# EAGLE design wifilight (EAGLE 7.5.0)
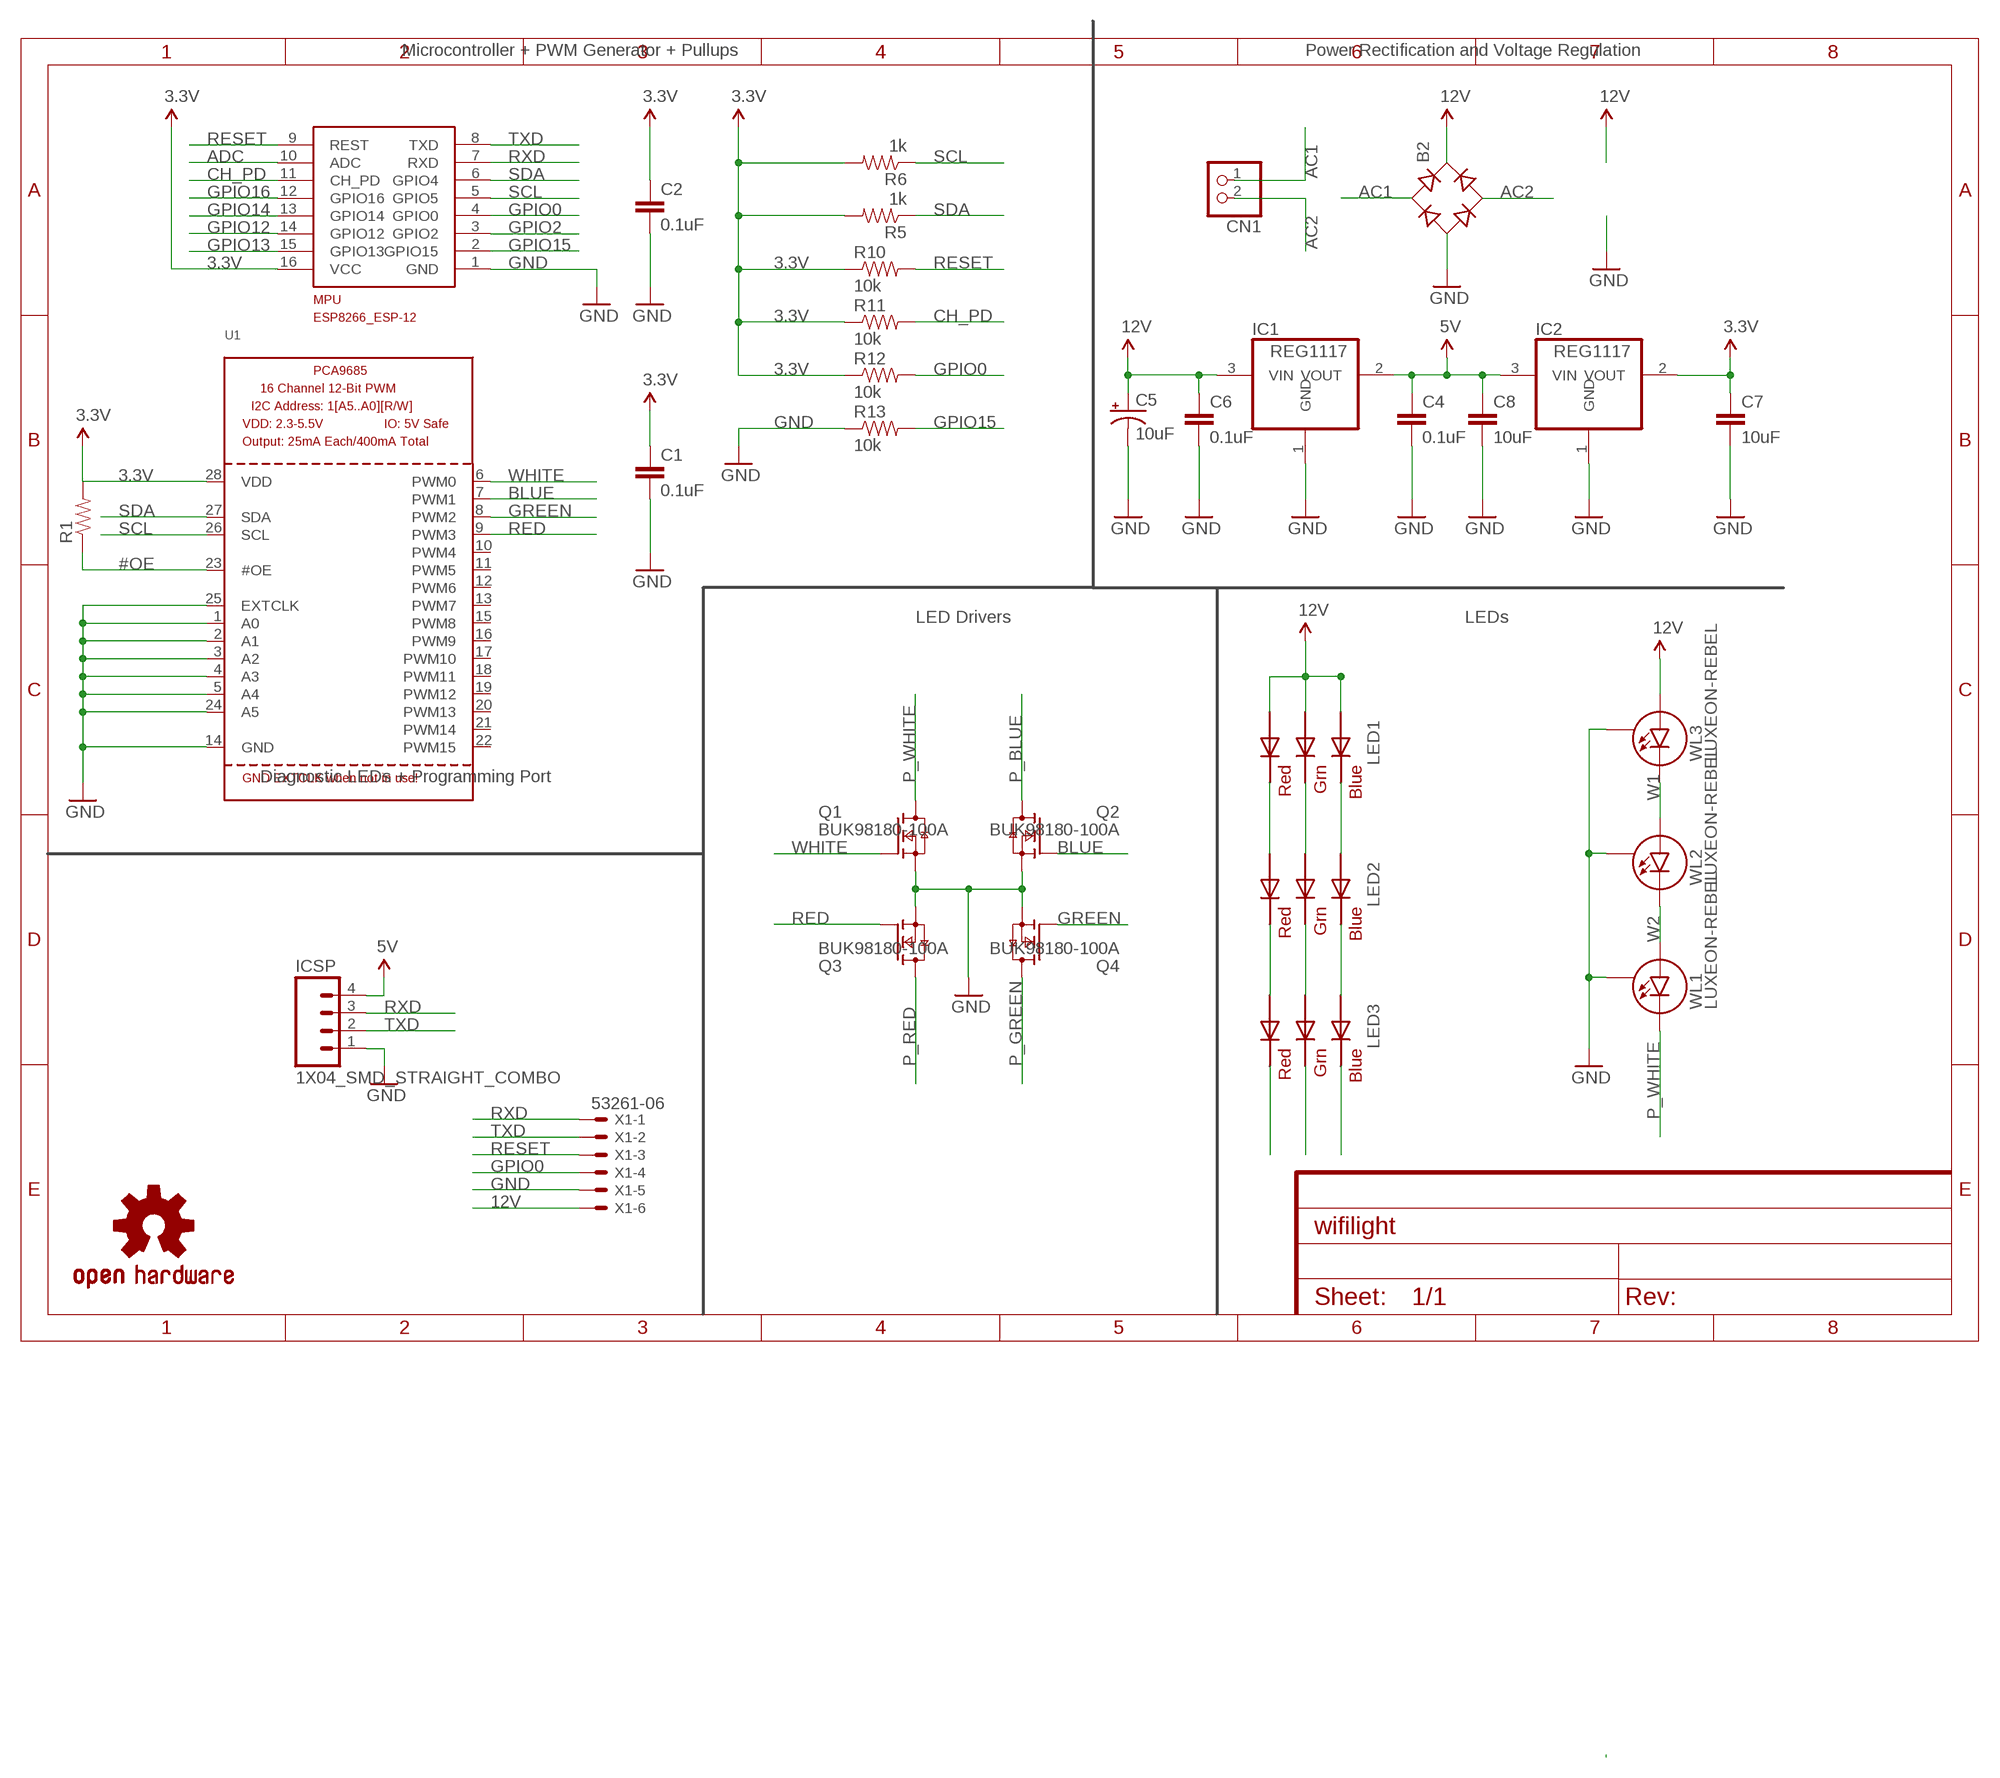
[diagram p0: schematic, sheet 1]

## Parts
B2  DBLS203G  [DBS]
C1  0.1uF  CAP1206  [1206]
C2  0.1uF  CAP1206  [1206]
C4  0.1uF  CAP1206  [1206]
C5  10uF  10UF-16V-10%(TANT)  [EIA3216]
C6  0.1uF  CAP1206  [1206]
C7  10uF  CAP1206  [1206]
C8  10uF  CAP1206  [1206]
CN1  JST_2PIN-THM  [JST-PH-2-THM]
IC1  REG1117  [SOT223]
IC2  REG1117  [SOT223]
ICSP  1X04_SMD_STRAIGHT_COMBO  M04SMD_STRAIGHT_COMBO  [1X04_SMD_STRAIGHT_COMBO]
LED1  RGBLED5050  [RGBLED5050]
LED2  RGBLED5050  [RGBLED5050]
LED3  RGBLED5050  [RGBLED5050]
LOGO1  OSHW-LOGOS  [OSHW-LOGO-S]
MPU  ESP8266_ESP-12  [ESP8266-ESP12]
Q1  BUK98180-100A  [SOT223]
Q2  BUK98180-100A  [SOT223]
Q3  BUK98180-100A  [SOT223]
Q4  BUK98180-100A  [SOT223]
R1  RESISTOR1206  [1206]
R5  1k  RESISTOR1206  [1206]
R6  1k  RESISTOR1206  [1206]
R10  10k  RESISTOR1206  [1206]
R11  10k  RESISTOR1206  [1206]
R12  10k  RESISTOR1206  [1206]
R13  10k  RESISTOR1206  [1206]
U1  PCA9685  [TSSOP28]
WL1  LUXEON-REBEL  [LUXEON-REBEL]
WL2  LUXEON-REBEL  [LUXEON-REBEL]
WL3  LUXEON-REBEL  [LUXEON-REBEL]
X1  53261-06  [53261-06]

## Nets
3.3V: C1.1 C2.1 C7.1 IC2.2(VOUT) MPU.16(VCC) R1.2 R5.2 R6.2 R10.1 R11.1 R12.1 U1.28(VDD)
5V: C4.1 C8.1 IC1.2(VOUT) IC2.3(VIN) ICSP.4
12V: B2.+ C5.A(+) C6.1 IC1.3(VIN) LED1.1(GREEN_A) LED1.2(RED_A) LED1.3(BLUE_A) WL3.ANODE(A) X1.6
#OE: R1.1 U1.23(#OE)
AC1: B2.AC1 CN1.1
AC2: B2.AC2 CN1.2
ADC: MPU.10(ADC)
BLUE: Q2.1(G) U1.7(PWM1)
CH_PD: MPU.11(CH_PD) R11.2
GND: B2.- C1.2 C2.2 C4.2 C5.C(-) C6.2 C7.2 C8.2 ICSP.1 MPU.1(GND) Q1.3(S) Q2.3(S) Q3.3(S) Q4.3(S) R13.1 U1.1(A0) U1.2(A1) U1.3(A2) U1.4(A3) U1.5(A4) U1.14(GND) U1.24(A5) U1.25(EXTCLK) WL1.P$3(S) WL2.P$3(S) WL3.P$3(S) X1.5
GPIO0: MPU.4(GPIO0) R12.2 X1.4
GPIO2: MPU.3(GPIO2)
GPIO12: MPU.14(GPIO12)
GPIO13: MPU.15(GPIO13)
GPIO14: MPU.13(GPIO14)
GPIO15: MPU.2(GPIO15) R13.2
GPIO16: MPU.12(GPIO16)
GREEN: Q4.1(G) U1.8(PWM2)
N$30: LED2.5(RED_C) LED3.2(RED_A)
N$31: LED2.6(GREEN_C) LED3.1(GREEN_A)
N$32: LED2.4(BLUE_C) LED3.3(BLUE_A)
N$33: LED1.5(RED_C) LED2.2(RED_A)
N$34: LED1.6(GREEN_C) LED2.1(GREEN_A)
N$35: LED1.4(BLUE_C) LED2.3(BLUE_A)
P_BLUE: LED3.4(BLUE_C) Q2.2(D) Q2.4(D)
P_GREEN: LED3.6(GREEN_C) Q4.2(D) Q4.4(D)
P_RED: LED3.5(RED_C) Q3.2(D) Q3.4(D)
P_WHITE: Q1.2(D) Q1.4(D) WL1.CATHODE(C)
RED: Q3.1(G) U1.9(PWM3)
RESET: MPU.9(REST) R10.2 X1.3
RXD: ICSP.3 MPU.7(RXD) X1.1
SCL: MPU.5(GPIO5) R6.1 U1.26(SCL)
SDA: MPU.6(GPIO4) R5.1 U1.27(SDA)
TXD: ICSP.2 MPU.8(TXD) X1.2
W1: WL2.ANODE(A) WL3.CATHODE(C)
W2: WL1.ANODE(A) WL2.CATHODE(C)
WHITE: Q1.1(G) U1.6(PWM0)
Unconnected: U1.10(PWM4) U1.11(PWM5) U1.12(PWM6) U1.13(PWM7) U1.15(PWM8) U1.16(PWM9) U1.17(PWM10) U1.18(PWM11) U1.19(PWM12) U1.20(PWM13) U1.21(PWM14) U1.22(PWM15)

## Notes on the sheet
- Microcontroller + PWM Generator + Pullups | Power Rectification and Voltage Regulation
- LED Drivers | LEDs
- Diagnostic LEDs + Programming Port

## Power pins joined to a net without a drawn wire
GND: IC1.1(GND) IC2.1(GND)

## Library data of the parts
B2 = rectifier:DB?*G: Single Phase 1.0 AMP Glass Passivated Bridge Rectifier Taiwan Semiconductor Co.,Ltd. - TSC Source: http://www.taiwansemi.com/TSCbig5/ezcatfiles/cust/img/img/db101g.pdf http://www.ts.com.tw/db/pictures/modules/PDT/PDT060207001/DBLS201G.pdf
C1 C2 C4 C6-C8 = SparkFun-Passives:CAP: Capacitor Standard 0603 ceramic capacitor, and 0.1" leaded capacitor.
C5 = SparkFun-Capacitors:10UF-16V-10%(TANT): CAP-00811 1206/EIA-3216 Tantalum capacitor; PROD_ID: CAP-00811
CN1 = adafruit:JST_2PIN: JST 2-Pin Connectors of various flavors SMT-RA (S2B-PH-SM4) 4UConnector #17311 SMT (B2B-PH-SM4) THM-RA (S2B-PH) THM (B2B-PH)
IC1 IC2 = burr-brown:REG1117: 800mA and 1A Low Dropout (LDO) Positive Regulator 1.8V, 2.5V, 2.85V, 3.3V, 5V, and Adj; MPN: REG1117; OC_FARNELL: 1097566; OC_NEWARK: 14P6981
ICSP = SparkFun-Connectors:M04: Header 4 Standard 4-pin 0.1" header. Use with straight break away headers (SKU : PRT-00116), right angle break away headers (PRT-00553), swiss pins (PRT-00743), machine pins (PRT-00117), and female headers (PRT-00115). Molex polarized connector foot print use with SKU : PRT-08231 with associated crimp pins and housings. 1MM SMD Version SKU: PRT-10208; PROD_ID: CONN-08511
LED1-LED3 = adafruit:RGBLED: For 5050 RGB LEDs, the order of the LEDs may vary from one manufacturer to another!
LOGO1 = SparkFun-Aesthetics:OSHW-LOGO: Open Source Hardware Logo This logo indicates the piece of hardware it is found on incorporates a OSHW license and/or adheres to the definition of open source hardware found here: http://freedomdefined.org/OSHW
MPU = ESP8266-ESP12:ESP8266_ESP-12
Q1-Q4 = nxp_60:BUK98180-100A: N-channel TrenchMOS logic level FET Logic level N-channel enhancement mode Field-Effect Transistor (FET) in a plastic package using TrenchMOS technology. This product has been designed and qualified to the appropriate AEC standard for use in automotive critical applications. AAL Eindhoven MK
R1 R10-R13 = SparkFun-Resistors:RESISTOR: Resistor Basic schematic elements and footprints for 0603, 1206, and PTH resistors.
R5 R6 = SparkFun-Passives:RESISTOR: Resistor Basic schematic elements and footprints for 0603, 1206, and PTH resistors.
U1 = adafruit:PCA9685: PCA9685 - 16 Channel 12-Bit I2C PWM Controller 5.0V tolerant 16 channel, 12-bit I2C PWM controller with 25mA per output (max. 400mA total) Digikey: 568-5931-1-ND
WL1-WL3 = SparkFun-LED:LUXEON-REBEL: Luxeon Rebel single-color high output LED
X1 = con-molex:53?-06: CONNECTOR wire to board 1.25 mm (.049 inch) pitch header; OC_FARNELL: 1125375; OC_NEWARK: unknown

## Board
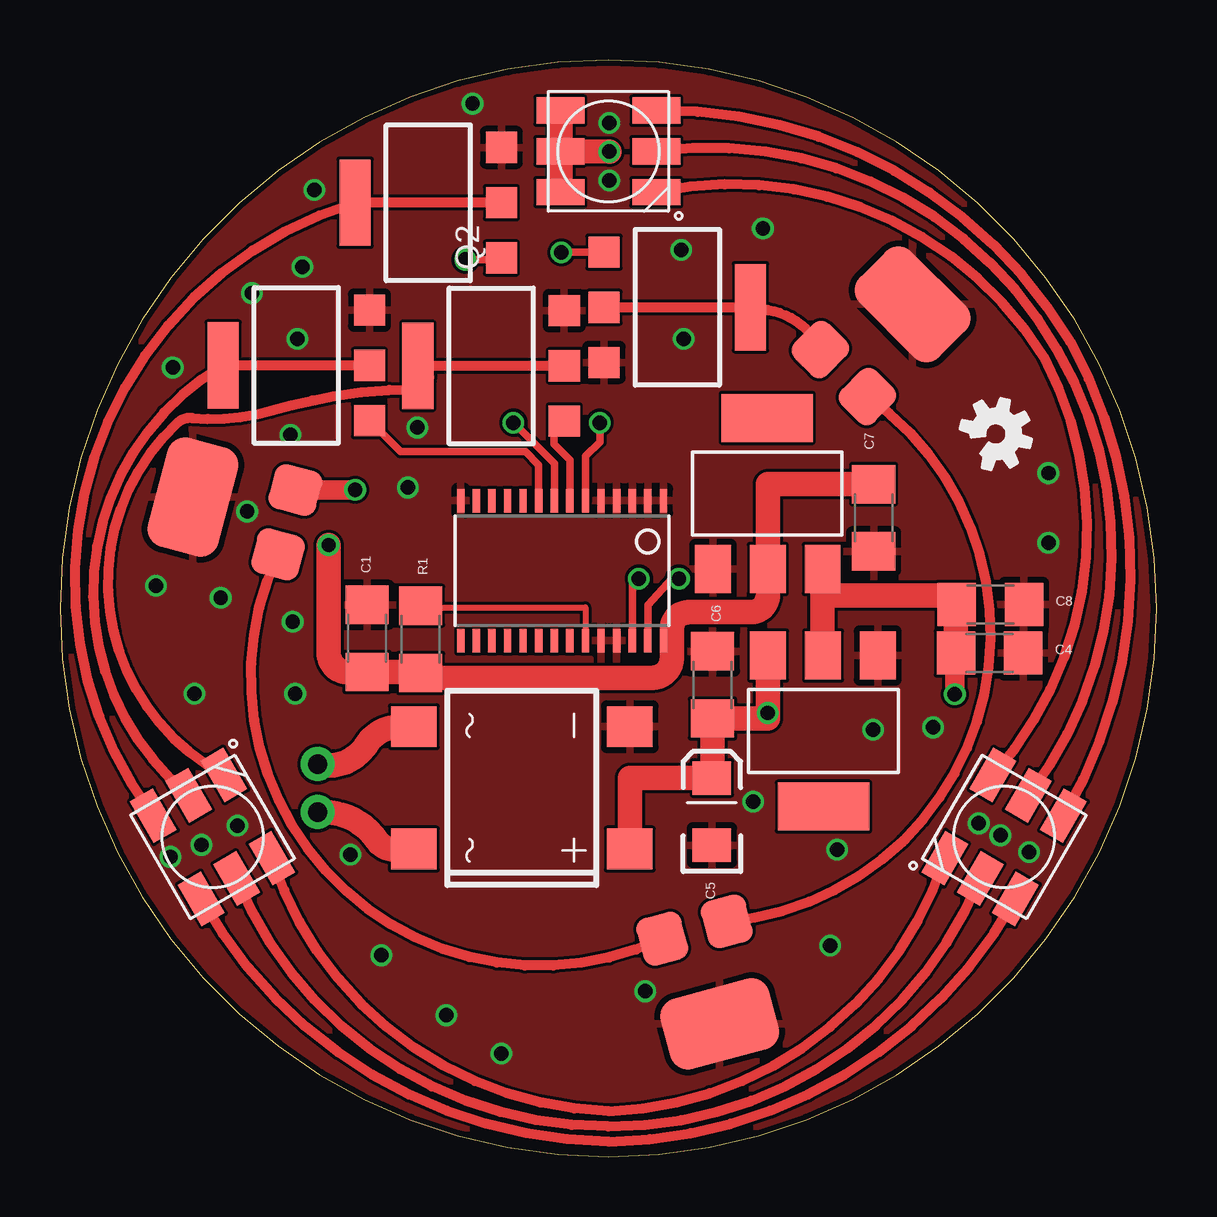
[diagram p1: board, top side]
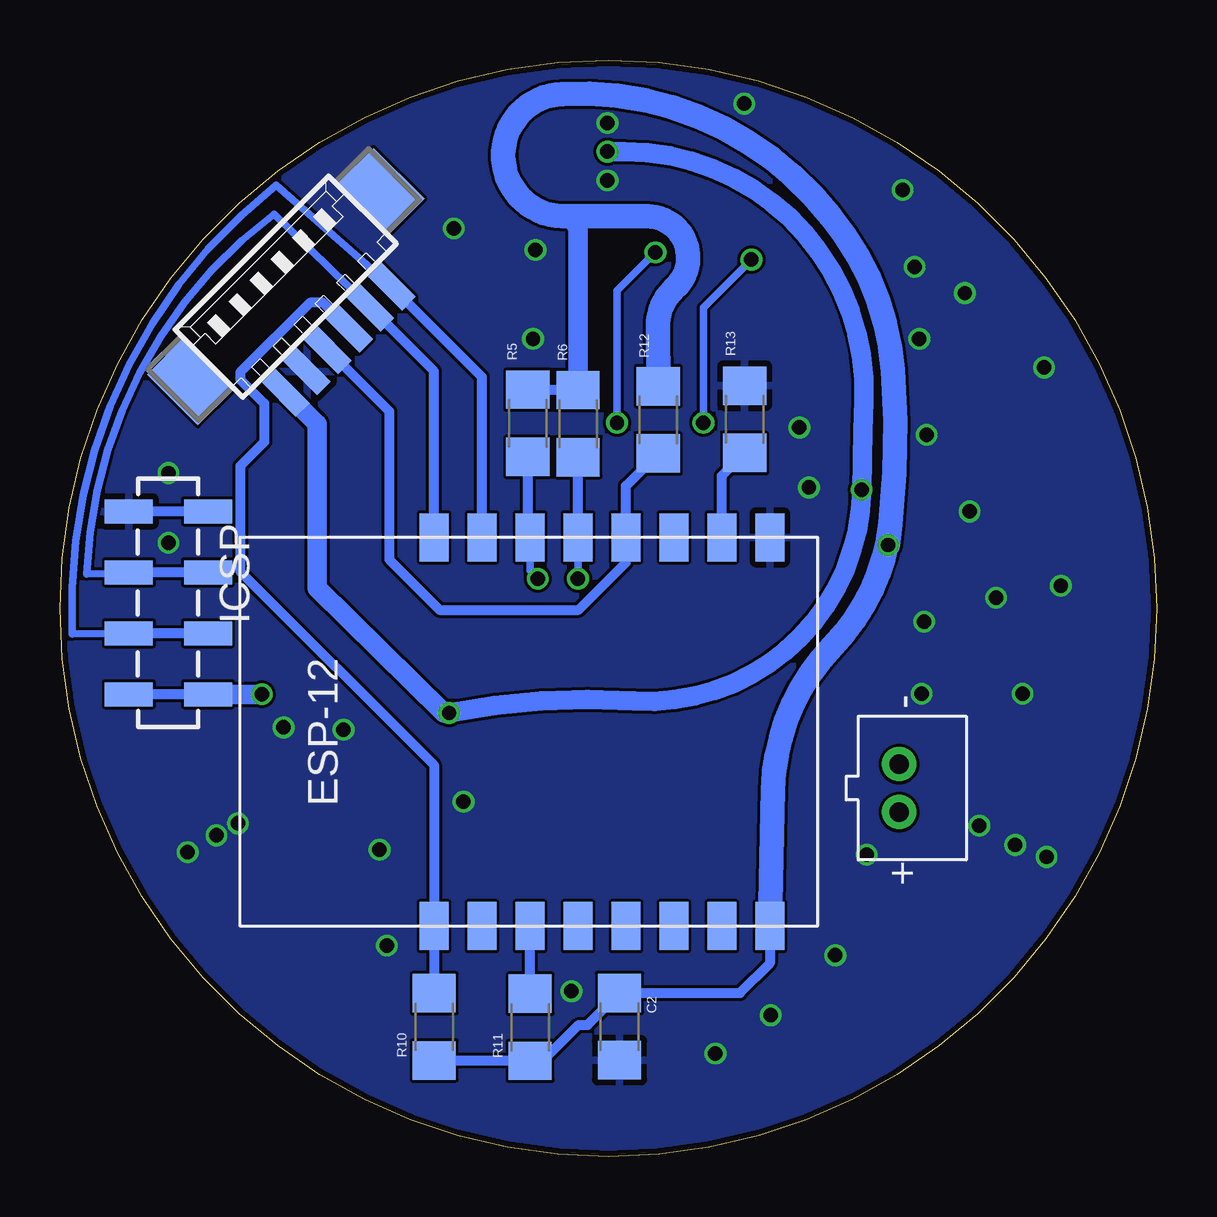
[diagram p2: board, bottom side, seen from below]

Size 45.72 x 45.72 mm. Coordinates in mm from the lower left corner, seen from the top.
Outline: 22.86,0 arc90 45.72,22.86 arc90 22.86,45.72 arc90 0,22.86 arc90 22.86,0
Copper layers (1*16): Top 0.035mm / dielectric 1.5mm / Bottom 0.035mm
Design rules "dirtypcbs": minimum track width 5mil, minimum drill 12mil, track to track 5mil, track to pad 5mil, pad to pad 5mil, via to via 5mil, smd to smd 0mil, copper to edge 10mil, drill to drill 10mil, minimum pad ring 10mil, minimum via ring 6mil, stop-mask expansion 2mil, vias tented up to drill 25mil, thermal gap 10mil

### Footprints (pad centres in the part's own frame; a part is rotated, then mirrored left to right if it is on the bottom)
DBS = smd 1.7 x 1.9: + -2.55,-4.5; - 2.55,-4.5; AC1 -2.55,4.5; AC2 2.55,4.5
1206 = smd 1.6 x 1.8: 1 -1.4,0; 2 1.4,0
EIA3216 = smd 1.4 x 1.6: A 1.4,0; C -1.4,0
JST-PH-2-THM = drill 0.8 pad 1.422: 1 1,0; 2 -1,0
SOT223 = smd 1.499 x 2.007: 1 -2.261,-3.15; 2 0.025,-3.15; 3 2.311,-3.15 | smd 3.81 x 2.007: 4 0,3.15
1X04_SMD_STRAIGHT_COMBO = smd 1 x 2: 1 0,-1.65; 1-2 0,1.65; 2 2.54,1.65; 2-2 2.54,-1.65; 3 5.08,-1.65; 3-2 5.08,1.65; 4 7.62,1.65; 4-2 7.62,-1.65
RGBLED5050 = smd 2 x 1.1: 1 -2,1.7; 2 -2,0; 3 -2,-1.7; 4 2,-1.7; 5 2,0; 6 2,1.7
ESP8266-ESP12 = smd 2 x 1.2: 1 16.2,2; 2 16.2,4; 3 16.2,6; 4 16.2,8; 5 16.2,10; 6 16.2,12; 7 16.2,14; 8 16.2,16; 9 0,16; 10 0,14; 11 0,12; 12 0,10; 13 0,8; 14 0,6; 15 0,4; 16 0,2
SOT223' = smd 1.3 x 1.3: 1 -2.3,-3.05; 2 0,-3.05; 3 2.3,-3.05 | smd 3.6 x 1.3: 4 0,3.05
TSSOP28 = smd 0.305 x 0.991: 1 -4.225,-2.918; 2 -3.575,-2.918; 3 -2.925,-2.918; 4 -2.275,-2.918; 5 -1.625,-2.918; 6 -0.975,-2.918; 7 -0.325,-2.918; 8 0.325,-2.918; 9 0.975,-2.918; 10 1.625,-2.918; 11 2.275,-2.918; 12 2.925,-2.918; 13 3.575,-2.918; 14 4.225,-2.918; 15 4.225,2.918; 16 3.575,2.918; 17 2.925,2.918; 18 2.275,2.918; 19 1.625,2.918; 20 0.975,2.918; 21 0.325,2.918; 22 -0.325,2.918; 23 -0.975,2.918; 24 -1.625,2.918; 25 -2.275,2.918; 26 -2.925,2.918; 27 -3.575,2.918; 28 -4.225,2.918
LUXEON-REBEL = smd 1.91 x 2.03: ANODE -1.39,2.63; CATHODE 1.39,2.63 | smd 4.68 x 3.03: P$3 0,-1.42
53261-06 = smd 0.8 x 2: 1 3.125,-2.5; 2 1.875,-2.5; 3 0.625,-2.5; 4 -0.625,-2.5; 5 -1.875,-2.5; 6 -3.125,-2.5 | smd 2.1 x 3: S1 5.625,0.625; S2 -5.625,0.625

### Placement (x,y rotation side)
B2  19.25,15.38 90 top
C1  12.8,21.61 90 top
C2  22.4,5.43 270 bottom
C4  38.75,21 0 top
C5  27.17,14.39 90 top
C6  27.2,19.67 90 top
C7  33.92,26.64 270 top
C8  38.78,23.02 0 top
CN1  10.74,15.37 270 bottom
IC1  31.83,17.75 180 top
IC2  29.48,27.65 0 top
ICSP  41.2,26.9 270 bottom
LED1  22.86,41.91 0 top
LED2  39.36,13.34 240 top
LED3  6.36,13.34 120 top
LOGO1  39.01,30.13 300 top
MPU  14.13,9.62 90 bottom
Q1  BUK98180-100A  [SOT223']  25.73,35.41 270 top
Q2  BUK98180-100A  [SOT223']  17.97,32.97 90 top
Q3  BUK98180-100A  [SOT223']  9.85,32.99 90 top
Q4  BUK98180-100A  [SOT223']  15.35,39.77 90 top
R1  15.03,21.57 270 top
R5  26.22,30.58 90 bottom
R6  24.12,30.56 90 bottom
R10  30.12,5.42 90 bottom
R11  26.12,5.4 90 bottom
R12  20.78,30.72 270 bottom
R13  17.18,30.74 270 bottom
U1  20.93,24.43 180 top
WL1  34.53,34.53 135 top
WL2  27.13,6.91 15 top
WL3  6.91,27.13 255 top
X1  35.87,35.83 45 bottom

### Tracks (layer width: path | path; a pad name or v marks a point on that pad's centre or on a via)
3.3V  (via drill 0.6)
  Top 0.254: R1.2 14.9,20.1 14.9,19.97
  Top 0.305: U1.28 25.31,21.51 arc90 25.5,21.7 | C1.1 14.39,20.21 arc-90 14.4,20.2
  Top 0.406: 24.7,19.97 25.16,19.97 | 14.77,20.21 R1.2
  Top 1.016: C7.1 29.5,28.04 IC2.2 29.5,23.41 arc-90 28.8,22.7 26.2,22.7 arc90 25.5,22 25.5,21.7 25.5,20.77 arc-90 24.7,19.97 14.9,19.97 | C1.1 14.77,20.21 | 14.4,20.2 12,20.2 arc-90 11.2,21 v11.2,25.5
  Bottom 0.406: R6.2 26.22,31.96 R5.2 | MPU.16 16.13,8.07 17.37,6.83 C2.1 23.73,5.5 24.1,5.5 25.6,4 R11.1 26.14,4.02 R10.1
  Bottom 0.813: R6.2 24.12,38.52 arc-90 24.8,39.2
  Bottom 1.016: R12.1 20.8,34.6 arc48 20.1,36.2 arc-142 21.4,39.2 24.8,39.2 arc175 24.8,44.3 arc55 13.6,39.2 arc35 11,32.8 arc11 11.1,26.4 | 11.1,26.4 arc38 13.5,21.3 arc-43 16,15.3 MPU.16 | v11.2,25.5 11.1,26.4
5V  (via drill 0.6)
  Top 0.305: 37.3,21 C4.1
  Top 0.813: v37.3,19.28 37.3,21
  Top 1.016: IC2.3 31.79,23.4 | 31.79,23.4 31.79,21.21 IC1.2 | C8.1 37.35,23.02 C4.1 37.35,23.4 31.79,23.4
  Bottom 0.813: ICSP.4 v37.3,19.28
12V  (via drill 0.6)
  Top 0.406: v29.5,18.5 29.37,18.57 C6.1
  Top 0.813: WL3.ANODE v12.29,27.79 arc90 v12.3,27.8
  Top 1.016: IC1.3 29.52,18.27 C6.1 27.2,16.09 C5.A 23.75,15.79 B2.+ | LED1.2 LED1.3 21.21,40.21 | LED1.2 LED1.1 | v22.9,41.9 LED1.2
  Bottom 0.406: 29.7,18.5 v29.5,18.5
  Bottom 0.813: X1.6 35,30.54 35,23.7 29.7,18.5 | v22.9,41.9 22.2,41.9 arc92 12.2,31.5 arc-1 v12.3,27.8 arc93 21.8,19 arc-14 v29.5,18.5
#OE
  Top 0.254: 14.9,22.9 21.91,22.9 U1.23
  Top 1.016: R1.1 14.9,23.07 14.9,22.9
AC1
  Top 1.016: B2.AC1 14,12.8 arc-58 13.2,13.2 arc60 CN1.1
AC2
  Top 1.016: B2.AC2 14,17.9 arc56 12.8,17.2 arc-73 CN1.2
BLUE
  Top 0.305: U1.7 21.25,29.05 20.6,29.7 20.6,30.25 Q2.1
CH_PD
  Bottom 0.406: R11.2 MPU.11
GND  (via drill 0.6)
  other vias: 14.9,30.4 10.6,40.3 26,34.1 29.3,38.7 25.9,37.8 17.2,43.9 22.9,43.1 22.9,40.7 9.9,34.1 10.1,37.1 4.7,32.9 7.4,13.8 5.9,13 4.6,12.5 5.6,19.3 9.8,19.3 12.1,12.6 9.7,22.3 6.7,23.3 4,23.8 7.8,26.9 9.6,30.1 8,36 14.5,27.9 18.4,4.3 16.1,5.9 13.4,8.4 24.4,6.9 32.1,8.8 32.4,12.8 28.9,14.8 33.9,17.8 40.4,12.7 39.2,13.4 38.3,13.9 36.4,17.9 41.2,25.6 41.2,28.5
  pour Top: 22.86,45.72 arc90 0,22.86 arc90 22.86,0 arc90 45.72,22.86 arc90
  pour Bottom: 22.86,45.72 arc90 0,22.86 arc90 22.86,0 arc90 45.72,22.86 arc90
GPIO0
  Bottom 0.406: R12.2 22.13,27.97 MPU.4 22.13,24.77 24.1,22.8 29.9,22.8 32,24.9 32,31.08 X1.4
GPIO15
  Bottom 0.406: MPU.2 18.13,28.39 R13.2
GREEN  (via drill 0.6)
  Top 0.305: U1.8 20.61,28.89 v18.9,30.6 | v16.9,37.4 18.33,37.4 Q4.1
  Bottom 0.305: v18.9,30.6 18.9,35.4 v16.9,37.4
N$30
  Top 0.406: LED3.2 arc68 22.86,1.27 arc68 LED2.5
N$31
  Top 0.406: LED3.1 arc60 22.86,0.64 arc60 LED2.6
N$32
  Top 0.406: LED3.3 arc70 22.86,1.91 arc70 LED2.4
N$33
  Top 0.406: LED1.5 arc-68 41.56,33.66 arc-68 LED2.2
N$34
  Top 0.406: LED1.6 arc-60 42.11,33.97 arc-60 LED2.1
N$35
  Top 0.406: LED2.3 arc70 41.01,33.34 arc70 LED1.4
P_BLUE
  Top 0.406: LED3.4 arc-109 4.9,30.6 arc-48 5.5,30.8 arc22 8.8,31.1 arc-6 11.4,31.7 arc-10 14.9,32 arc178 Q2.4 Q2.2
P_GREEN
  Top 0.406: LED3.6 arc-110 Q4.4 Q4.2
P_RED
  Top 0.406: LED3.5 arc-110 Q3.4 Q3.2
P_WHITE
  Top 0.406: WL1.CATHODE arc56 29.5,35.3 Q1.4 Q1.2
RED
  Top 0.305: Q3.1 14.19,29.4 19.4,29.4 19.95,28.84 U1.9
RESET
  Bottom 0.406: R10.2 MPU.9 30.13,16.33 38.2,24.4 38.2,28.8 37.2,29.8 37.2,31.4 38.2,32.4 38.2,32.7 35.3,35.6 34.76,35.6 X1.3
RXD
  Bottom 0.305: ICSP.3 45.2,21.8 arc55 36.7,40.5 X1.1
  Bottom 0.406: MPU.7 28.13,32.51 X1.1
SCL  (via drill 0.6)
  Top 0.305: U1.26 23.86,23.82 v24.13,24.1
  Bottom 0.305: v24.13,24.1 MPU.5
  Bottom 0.406: MPU.5 R6.1
SDA  (via drill 0.6)
  Top 0.305: v25.8,24.1 25.5,24.1 24.5,23 U1.27
  Bottom 0.305: MPU.6 26.13,24.43 v25.8,24.1
  Bottom 0.406: MPU.6 26.22,25.82 R5.1
TXD
  Bottom 0.305: ICSP.2 44.6,24.3 arc51 36.8,39.3 32.19,34.81
  Bottom 0.406: MPU.8 30.13,32.74 32.19,34.81 X1.2
W1
  Top 0.406: WL2.ANODE arc-140 WL3.CATHODE
W2
  Top 0.406: WL2.CATHODE arc140 WL1.ANODE
WHITE  (via drill 0.6)
  Top 0.305: U1.6 21.91,29.2 22.5,29.8 v22.5,30.6 | v20.9,37.7 Q1.1
  Bottom 0.305: v22.5,30.6 22.5,36.1 v20.9,37.7